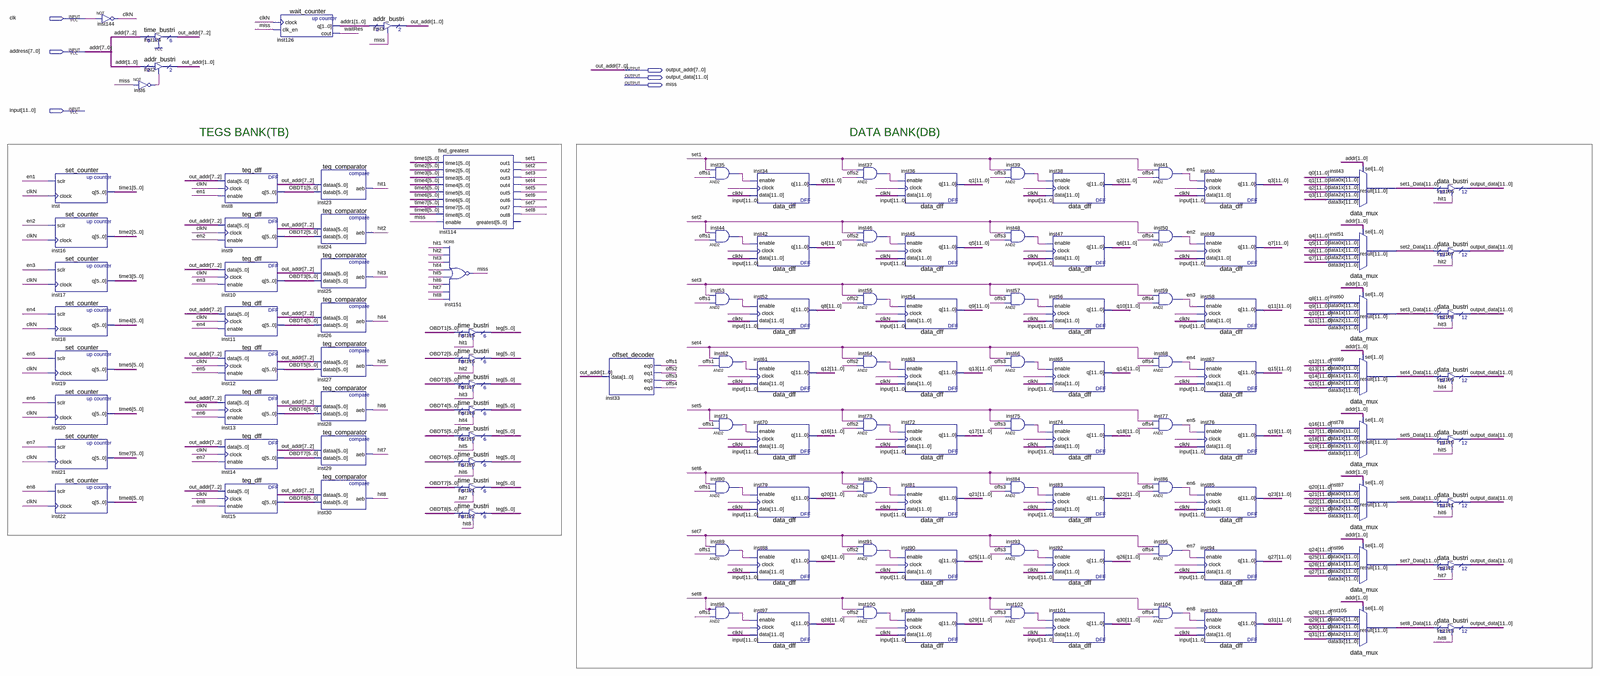
[diagram p0: schematic sheet, whole]
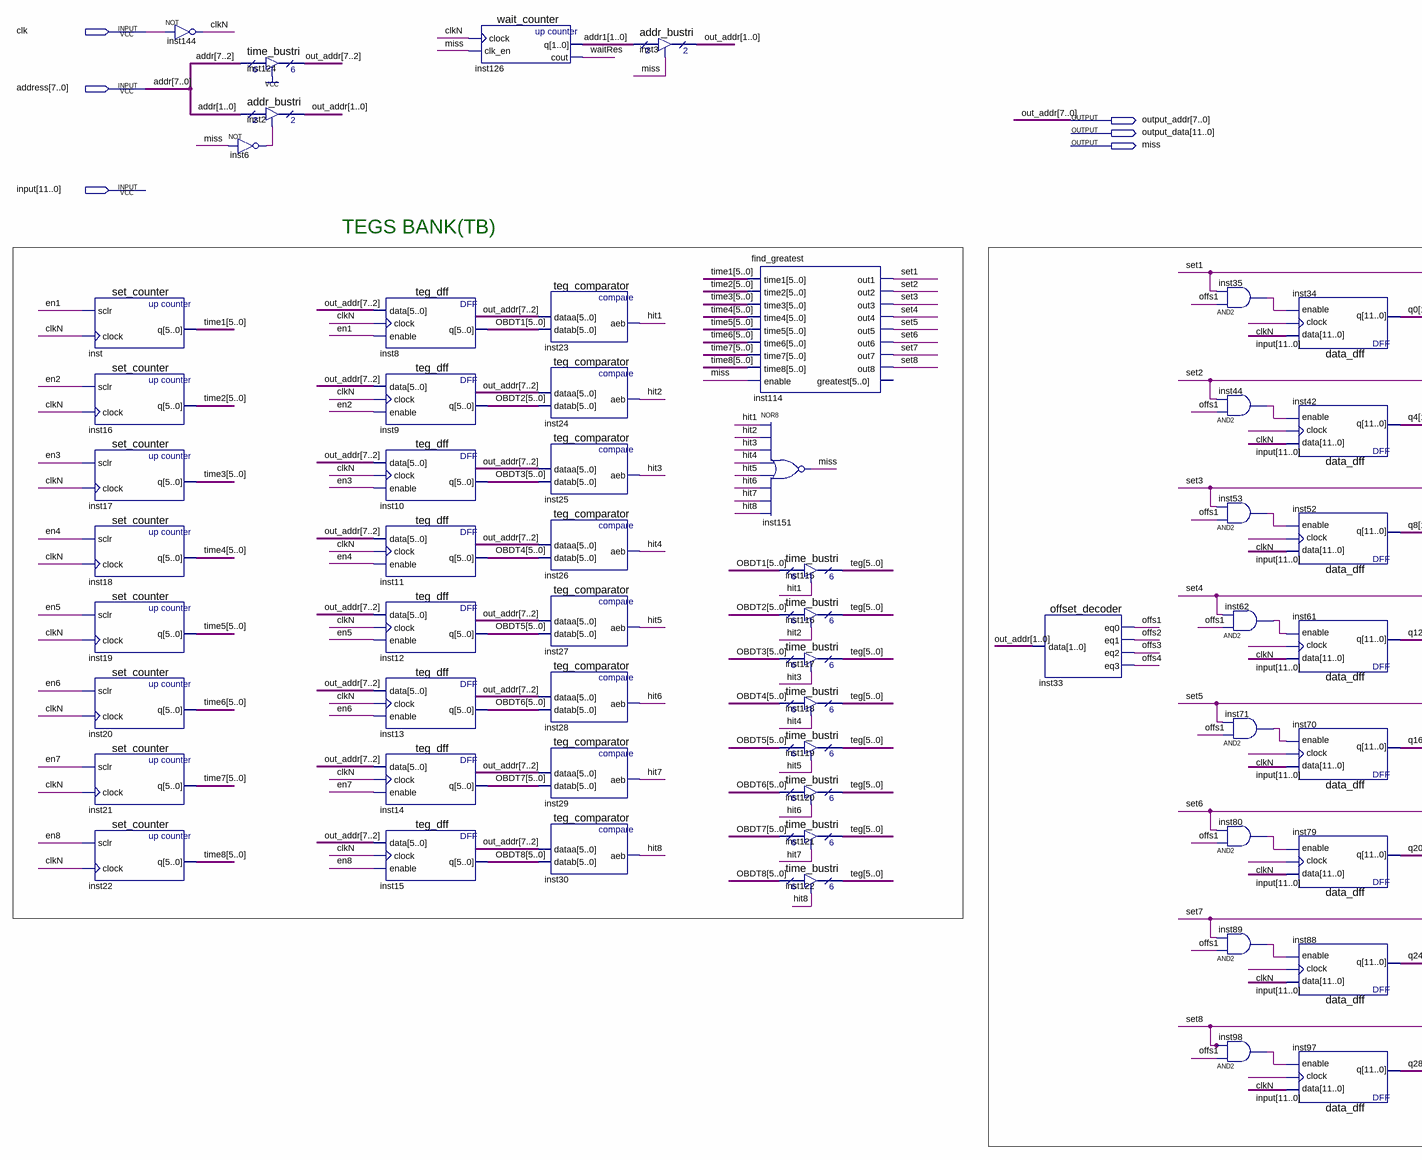
[diagram p1: schematic sheet, left part]
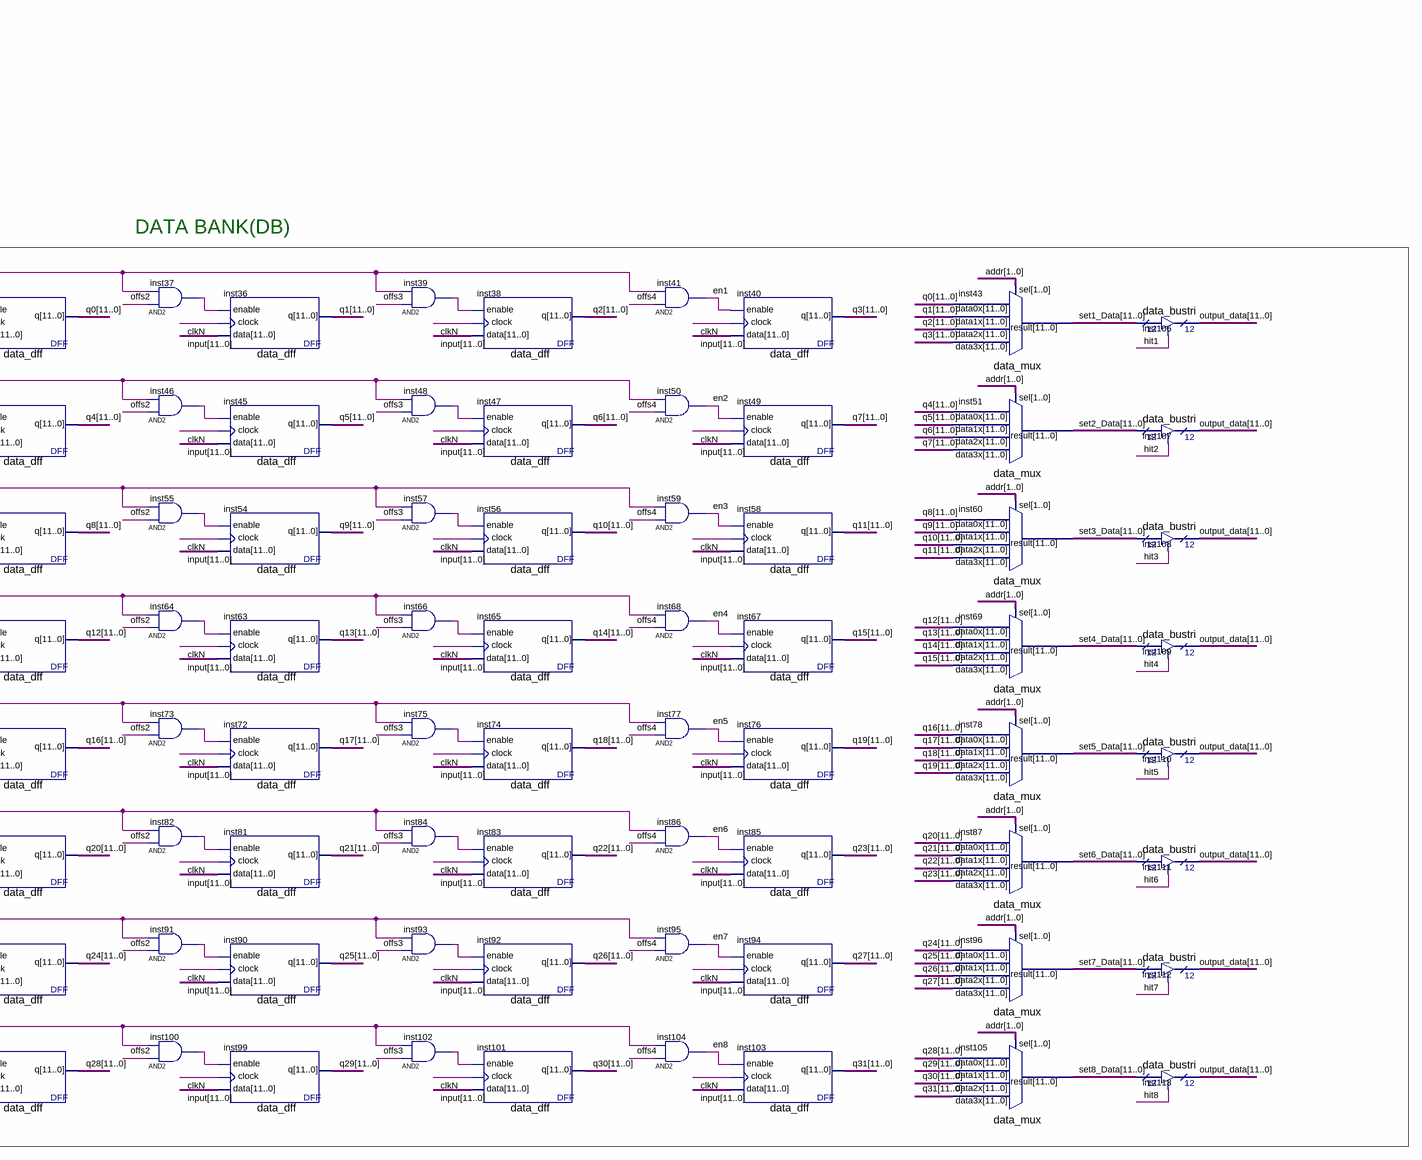
[diagram p2: schematic sheet, right part]
// Quartus schematic Cache.bdf as structural Verilog: 121 symbols, 6 pins
module Cache (
  input  clk,
  input  [7:0] address,
  input  [11:0] \input ,
  output [7:0] output_addr,
  output [11:0] output_data,
  output miss
);

  wire clkN, en1, en2, en3, en4, en5, en6, en7, en8, hit1, hit2, hit3, hit4, hit5, hit6, hit7, hit8,
       inst6_out, inst35_out, inst37_out, inst39_out, inst44_out, inst46_out, inst48_out, inst53_out,
       inst55_out, inst57_out, inst62_out, inst64_out, inst66_out, inst71_out, inst73_out, inst75_out,
       inst80_out, inst82_out, inst84_out, inst89_out, inst91_out, inst93_out, inst98_out, inst100_out,
       inst102_out, offs1, offs2, offs3, offs4, set1, set2, set3, set4, set5, set6, set7, set8, waitRes;
  wire [1:0] addr1;
  wire [5:0] OBDT1, OBDT2, OBDT3, OBDT4, OBDT5, OBDT6, OBDT7, OBDT8, teg, time1, time2, time3, time4, time5,
       time6, time7, time8;
  wire [11:0] q0, q1, q2, q3, q4, q5, q6, q7, q8, q9, q10, q11, q12, q13, q14, q15, q16, q17, q18, q19, q20,
       q21, q22, q23, q24, q25, q26, q27, q28, q29, q30, q31, set1_Data, set2_Data, set3_Data, set4_Data,
       set5_Data, set6_Data, set7_Data, set8_Data;

  set_counter inst (.sclr(en1), .clock(clkN), .q(time1));
  set_counter inst16 (.sclr(en2), .clock(clkN), .q(time2));
  set_counter inst17 (.sclr(en3), .clock(clkN), .q(time3));
  set_counter inst18 (.sclr(en4), .clock(clkN), .q(time4));
  set_counter inst19 (.sclr(en5), .clock(clkN), .q(time5));
  set_counter inst20 (.sclr(en6), .clock(clkN), .q(time6));
  set_counter inst21 (.sclr(en7), .clock(clkN), .q(time7));
  set_counter inst22 (.sclr(en8), .clock(clkN), .q(time8));
  not inst144 (clkN, clk);
  not inst6 (inst6_out, miss);
  time_bustri inst124 (.enabledt(1'b1), .data(address[7:2]), .tridata(output_addr[7:2]));
  addr_bustri inst2 (.enabledt(inst6_out), .data(address[1:0]), .tridata(output_addr[1:0]));
  teg_dff inst8 (.data(output_addr[7:2]), .clock(clkN), .enable(en1), .q(OBDT1));
  teg_dff inst9 (.data(output_addr[7:2]), .clock(clkN), .enable(en2), .q(OBDT2));
  teg_dff inst10 (.data(output_addr[7:2]), .clock(clkN), .enable(en3), .q(OBDT3));
  teg_dff inst11 (.data(output_addr[7:2]), .clock(clkN), .enable(en4), .q(OBDT4));
  teg_dff inst12 (.data(output_addr[7:2]), .clock(clkN), .enable(en5), .q(OBDT5));
  teg_dff inst13 (.data(output_addr[7:2]), .clock(clkN), .enable(en6), .q(OBDT6));
  teg_dff inst14 (.data(output_addr[7:2]), .clock(clkN), .enable(en7), .q(OBDT7));
  teg_dff inst15 (.data(output_addr[7:2]), .clock(clkN), .enable(en8), .q(OBDT8));
  wait_counter inst126 (.clock(clkN), .clk_en(miss), .q(addr1), .cout(waitRes));
  teg_comparator inst23 (.dataa(output_addr[7:2]), .datab(OBDT1), .aeb(hit1));
  teg_comparator inst24 (.dataa(output_addr[7:2]), .datab(OBDT2), .aeb(hit2));
  teg_comparator inst25 (.dataa(output_addr[7:2]), .datab(OBDT3), .aeb(hit3));
  teg_comparator inst26 (.dataa(output_addr[7:2]), .datab(OBDT4), .aeb(hit4));
  teg_comparator inst27 (.dataa(output_addr[7:2]), .datab(OBDT5), .aeb(hit5));
  teg_comparator inst28 (.dataa(output_addr[7:2]), .datab(OBDT6), .aeb(hit6));
  teg_comparator inst29 (.dataa(output_addr[7:2]), .datab(OBDT7), .aeb(hit7));
  teg_comparator inst30 (.dataa(output_addr[7:2]), .datab(OBDT8), .aeb(hit8));
  addr_bustri inst3 (.enabledt(miss), .data(addr1), .tridata(output_addr[1:0]));
  find_greatest inst114 (
    .time1(time1), .time2(time2), .time3(time3), .time4(time4), .time5(time5), .time6(time6), .time7(time7),
    .time8(time8), .enable(miss), .out1(set1), .out2(set2), .out3(set3), .out4(set4), .out5(set5),
    .out6(set6), .out7(set7), .out8(set8));  // open: greatest
  nor inst151 (miss, hit1, hit2, hit3, hit4, hit5, hit6, hit7, hit8);
  time_bustri inst115 (.enabledt(hit1), .data(OBDT1), .tridata(teg));
  time_bustri inst116 (.enabledt(hit2), .data(OBDT2), .tridata(teg));
  time_bustri inst117 (.enabledt(hit3), .data(OBDT3), .tridata(teg));
  time_bustri inst118 (.enabledt(hit4), .data(OBDT4), .tridata(teg));
  time_bustri inst119 (.enabledt(hit5), .data(OBDT5), .tridata(teg));
  time_bustri inst120 (.enabledt(hit6), .data(OBDT6), .tridata(teg));
  time_bustri inst121 (.enabledt(hit7), .data(OBDT7), .tridata(teg));
  time_bustri inst122 (.enabledt(hit8), .data(OBDT8), .tridata(teg));
  offset_decoder inst33 (.data(output_addr[1:0]), .eq0(offs1), .eq1(offs2), .eq2(offs3), .eq3(offs4));
  and inst35 (inst35_out, offs1, set1);
  and inst44 (inst44_out, offs1, set2);
  and inst53 (inst53_out, offs1, set3);
  and inst62 (inst62_out, offs1, set4);
  and inst71 (inst71_out, offs1, set5);
  and inst80 (inst80_out, offs1, set6);
  and inst89 (inst89_out, offs1, set7);
  and inst98 (inst98_out, offs1, set8);
  data_dff inst34 (.data(\input ), .clock(clkN), .enable(inst35_out), .q(q0));
  data_dff inst42 (.data(\input ), .clock(clkN), .enable(inst44_out), .q(q4));
  data_dff inst52 (.data(\input ), .clock(clkN), .enable(inst53_out), .q(q8));
  data_dff inst61 (.data(\input ), .clock(clkN), .enable(inst62_out), .q(q12));
  data_dff inst70 (.data(\input ), .clock(clkN), .enable(inst71_out), .q(q16));
  data_dff inst79 (.data(\input ), .clock(clkN), .enable(inst80_out), .q(q20));
  data_dff inst88 (.data(\input ), .clock(clkN), .enable(inst89_out), .q(q24));
  data_dff inst97 (.data(\input ), .clock(clkN), .enable(inst98_out), .q(q28));
  and inst37 (inst37_out, offs2, set1);
  and inst46 (inst46_out, offs2, set2);
  and inst55 (inst55_out, offs2, set3);
  and inst64 (inst64_out, offs2, set4);
  and inst73 (inst73_out, offs2, set5);
  and inst82 (inst82_out, offs2, set6);
  and inst91 (inst91_out, offs2, set7);
  and inst100 (inst100_out, offs2, set8);
  data_dff inst36 (.data(\input ), .clock(clkN), .enable(inst37_out), .q(q1));
  data_dff inst45 (.data(\input ), .clock(clkN), .enable(inst46_out), .q(q5));
  data_dff inst54 (.data(\input ), .clock(clkN), .enable(inst55_out), .q(q9));
  data_dff inst63 (.data(\input ), .clock(clkN), .enable(inst64_out), .q(q13));
  data_dff inst72 (.data(\input ), .clock(clkN), .enable(inst73_out), .q(q17));
  data_dff inst81 (.data(\input ), .clock(clkN), .enable(inst82_out), .q(q21));
  data_dff inst90 (.data(\input ), .clock(clkN), .enable(inst91_out), .q(q25));
  data_dff inst99 (.data(\input ), .clock(clkN), .enable(inst100_out), .q(q29));
  and inst39 (inst39_out, offs3, set1);
  and inst48 (inst48_out, offs3, set2);
  and inst57 (inst57_out, offs3, set3);
  and inst66 (inst66_out, offs3, set4);
  and inst75 (inst75_out, offs3, set5);
  and inst84 (inst84_out, offs3, set6);
  and inst93 (inst93_out, offs3, set7);
  and inst102 (inst102_out, offs3, set8);
  data_dff inst38 (.data(\input ), .clock(clkN), .enable(inst39_out), .q(q2));
  data_dff inst47 (.data(\input ), .clock(clkN), .enable(inst48_out), .q(q6));
  data_dff inst56 (.data(\input ), .clock(clkN), .enable(inst57_out), .q(q10));
  data_dff inst65 (.data(\input ), .clock(clkN), .enable(inst66_out), .q(q14));
  data_dff inst74 (.data(\input ), .clock(clkN), .enable(inst75_out), .q(q18));
  data_dff inst83 (.data(\input ), .clock(clkN), .enable(inst84_out), .q(q22));
  data_dff inst92 (.data(\input ), .clock(clkN), .enable(inst93_out), .q(q26));
  data_dff inst101 (.data(\input ), .clock(clkN), .enable(inst102_out), .q(q30));
  and inst41 (en1, offs4, set1);
  and inst50 (en2, offs4, set2);
  and inst59 (en3, offs4, set3);
  and inst68 (en4, offs4, set4);
  and inst77 (en5, offs4, set5);
  and inst86 (en6, offs4, set6);
  and inst95 (en7, offs4, set7);
  and inst104 (en8, offs4, set8);
  data_dff inst40 (.data(\input ), .clock(clkN), .enable(en1), .q(q3));
  data_dff inst49 (.data(\input ), .clock(clkN), .enable(en2), .q(q7));
  data_dff inst58 (.data(\input ), .clock(clkN), .enable(en3), .q(q11));
  data_dff inst67 (.data(\input ), .clock(clkN), .enable(en4), .q(q15));
  data_dff inst76 (.data(\input ), .clock(clkN), .enable(en5), .q(q19));
  data_dff inst85 (.data(\input ), .clock(clkN), .enable(en6), .q(q23));
  data_dff inst94 (.data(\input ), .clock(clkN), .enable(en7), .q(q27));
  data_dff inst103 (.data(\input ), .clock(clkN), .enable(en8), .q(q31));
  data_mux inst43 (.data3x(q3), .data2x(q2), .data1x(q1), .data0x(q0), .sel(address[1:0]), .result(set1_Data));
  data_mux inst51 (.data3x(q7), .data2x(q6), .data1x(q5), .data0x(q4), .sel(address[1:0]), .result(set2_Data));
  data_mux inst60 (.data3x(q11), .data2x(q10), .data1x(q9), .data0x(q8), .sel(address[1:0]), .result(set3_Data));
  data_mux inst69 (.data3x(q15), .data2x(q14), .data1x(q13), .data0x(q12), .sel(address[1:0]), .result(set4_Data));
  data_mux inst78 (.data3x(q19), .data2x(q18), .data1x(q17), .data0x(q16), .sel(address[1:0]), .result(set5_Data));
  data_mux inst87 (.data3x(q23), .data2x(q22), .data1x(q21), .data0x(q20), .sel(address[1:0]), .result(set6_Data));
  data_mux inst96 (.data3x(q27), .data2x(q26), .data1x(q25), .data0x(q24), .sel(address[1:0]), .result(set7_Data));
  data_mux inst105 (.data3x(q31), .data2x(q30), .data1x(q29), .data0x(q28), .sel(address[1:0]), .result(set8_Data));
  data_bustri inst106 (.enabledt(hit1), .data(set1_Data), .tridata(output_data));
  data_bustri inst107 (.enabledt(hit2), .data(set2_Data), .tridata(output_data));
  data_bustri inst108 (.enabledt(hit3), .data(set3_Data), .tridata(output_data));
  data_bustri inst109 (.enabledt(hit4), .data(set4_Data), .tridata(output_data));
  data_bustri inst110 (.enabledt(hit5), .data(set5_Data), .tridata(output_data));
  data_bustri inst111 (.enabledt(hit6), .data(set6_Data), .tridata(output_data));
  data_bustri inst112 (.enabledt(hit7), .data(set7_Data), .tridata(output_data));
  data_bustri inst113 (.enabledt(hit8), .data(set8_Data), .tridata(output_data));

  // Other names for the same wires on the sheet: addr[7:0] = address; out_addr[7:0] = output_addr

  // Notes on the sheet:
  //   TEGS BANK(TB)
  //   DATA BANK(DB)
endmodule
